# EasyEDA Pro project MAX5864_REUSE.eprj, schematic Schematic1_1
Create Date: 2024-10-05; Page Name: P1; Project Name: MAX5864_REUSE; Schematic Name: Schematic1; Update Date: 2024-10-15; Company: EasyEDA.com; Drawn: EasyEDA; Page Size: A4; Part Number: JLCPCB-002; Reviewed: EasyEDA; Version: V0.1
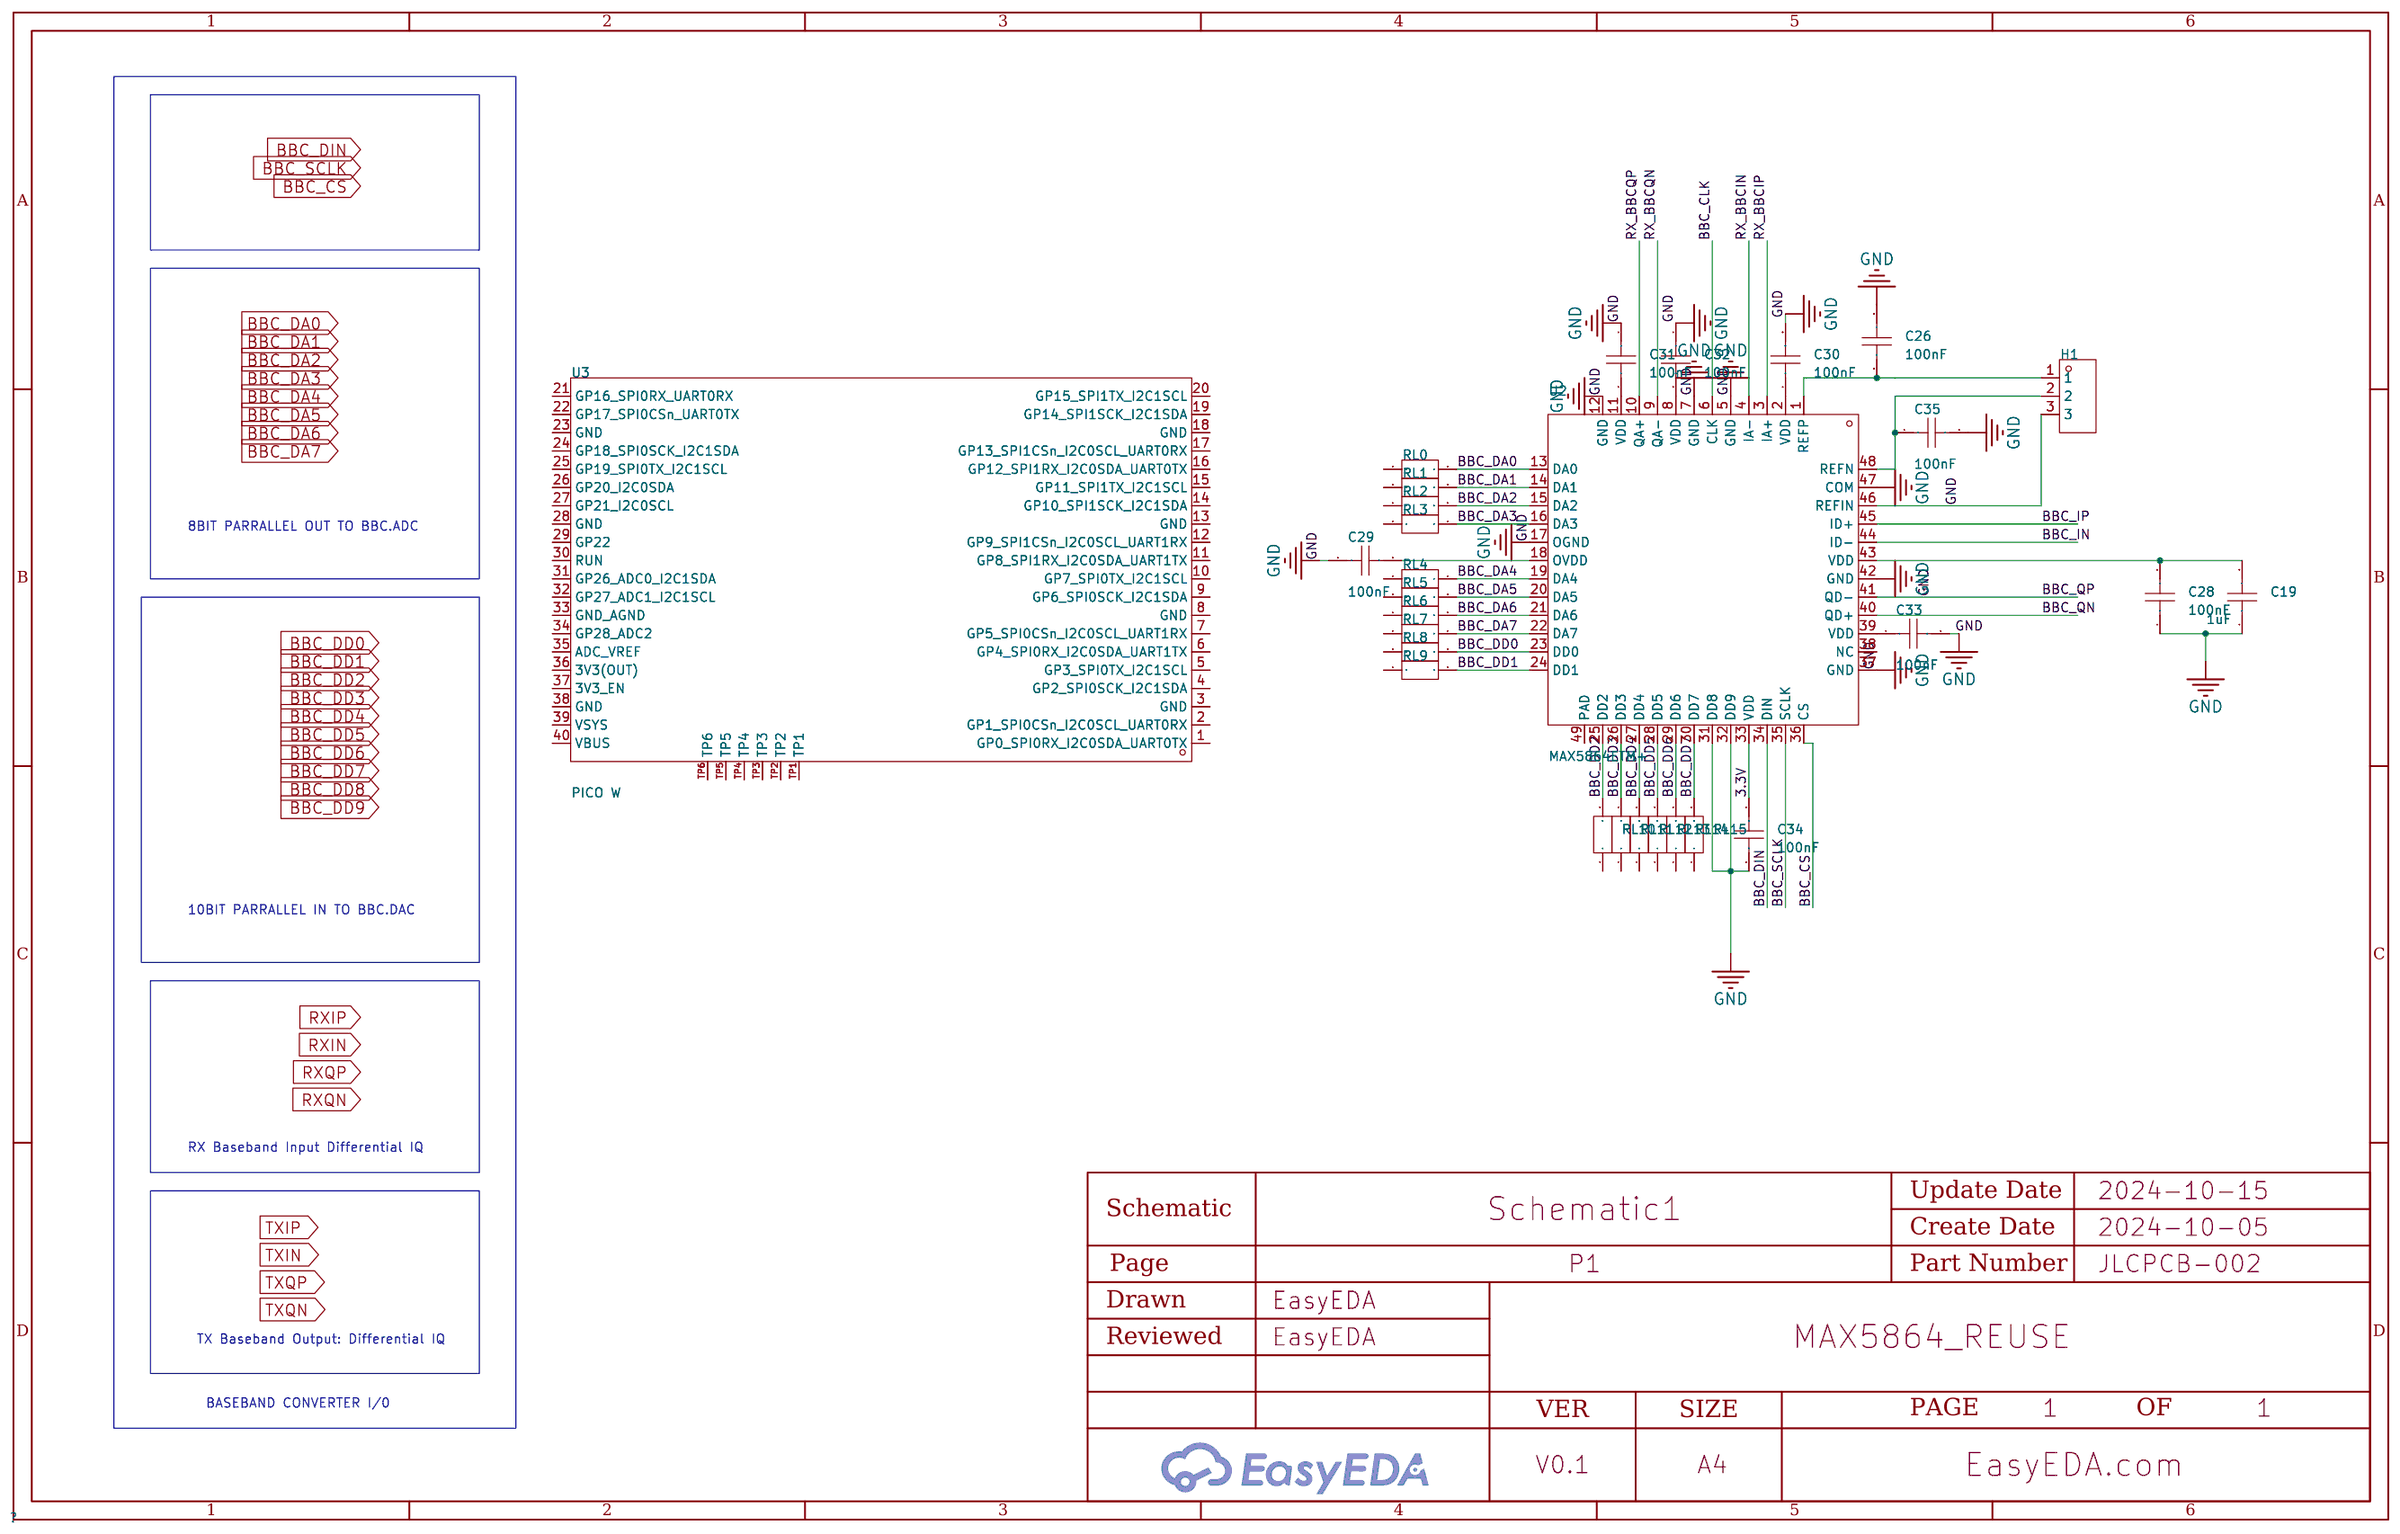
[diagram p3: schematic sheet]

## Parts
C19  1uF  [CAP-TH_L7.2-W2.5-P5.00-D0.6]
C26  100nF  [C0805]
C28  100nF  [C0805]
C29  100nF  [C0805]
C30  100nF  [C0805]
C31  100nF  [C0805]
C32  100nF  [C0805]
C33  100nF  [C0805]
C34  100nF  [C0805]
C35  100nF  [C0805]
H1  -  [HDR-TH_3P-P2.54-V-M]
RL0  PFC-W0805LF-03-1301-B  [R0805]
RL1  PFC-W0805LF-03-1301-B  [R0805]
RL2  PFC-W0805LF-03-1301-B  [R0805]
RL3  PFC-W0805LF-03-1301-B  [R0805]
RL4  PFC-W0805LF-03-1301-B  [R0805]
RL5  PFC-W0805LF-03-1301-B  [R0805]
RL6  PFC-W0805LF-03-1301-B  [R0805]
RL7  PFC-W0805LF-03-1301-B  [R0805]
RL8  PFC-W0805LF-03-1301-B  [R0805]
RL9  PFC-W0805LF-03-1301-B  [R0805]
RL10  PFC-W0805LF-03-1301-B  [R0805]
RL11  PFC-W0805LF-03-1301-B  [R0805]
RL12  PFC-W0805LF-03-1301-B  [R0805]
RL13  PFC-W0805LF-03-1301-B  [R0805]
RL14  PFC-W0805LF-03-1301-B  [R0805]
RL15  PFC-W0805LF-03-1301-B  [R0805]
U2  MAX5864ETM+  [QFN-48_L7.0-W7.0-P0.50-BL-EP5.1]
U3  PICO W  [COMM-SMD_L51.0-W21.0-P2.54_PICOW]

## Library data of the parts
C19 = SMEC334J100M2: Capacitance: Tolerance:±5% Tolerance:±5% Voltage Rated:; LCSC Part Name: 330nF ±5% 100V; Supplier Part: C401104; Manufacturer: CHAMPION(全鹏); Supplier Footprint: 插件,P=5mm; JLCPCB Part Class: Extended Part; Datasheet: https://atta.szlcsc.com/upload/public/pdf/source/20190730/C401104_3330673C3D333BC9993FC47731C2A492.pdf; Supplier: LCSC; Tolerance: ±5%
C26 C28-C35 = CAP_0805: Supplier Footprint: 0805
H1 = HDR-M_2.54_1x3P: Supplier Footprint: Through
RL0-RL15 = PFC-W0805LF-03-1301-B: Supplier Part: C22384601; JLCPCB Part Class: Extended Part; Supplier: LCSC
U2 = MAX5864ETM+: Supply Voltage:2.7V~3.3V Supply Voltage:2.7V~3.3V; LCSC Part Name: MAX5864ETM; Supplier Part: C143525; Manufacturer: ADI(亚德诺)/MAXIM(美信); Supplier Footprint: QFN-48-EP(7x7); JLCPCB Part Class: Extended Part; Datasheet: https://atta.szlcsc.com/upload/public/pdf/source/20171204/C143525_15123772477351162683.pdf; Supplier: LCSC; Supply Voltage: 2.7V~3.3V
U3 = PICO W: Supplier Part: C7203003; Manufacturer: Raspberry Pi(树莓派); JLCPCB Part Class: Extended Part; Datasheet: https://atta.szlcsc.com/upload/public/pdf/source/20230906/10B4C0665D815973E97A5F4971CA719F.pdf; Supplier: LCSC

## Nets
3.3V: C34.1 U2.33(VDD)
GND: C19.1 C26.1 C28.1 C29.1 C30.2 C31.1 C32.1 C33.2 C34.2 C35.2 U2.5(GND) U2.7(GND) U2.12(GND) U2.17(OGND) U2.31(DD8) U2.32(DD9) U2.37(GND) U2.42(GND) U2.47(COM)
BBC_CLK: U2.6(CLK)
BBC_CS: U2.36(CS)
BBC_DA0: RL0.2 U2.13(DA0)
BBC_DA1: RL1.2 U2.14(DA1)
BBC_DA2: RL2.2 U2.15(DA2)
BBC_DA3: RL3.2 U2.16(DA3)
BBC_DA4: RL4.2 U2.19(DA4)
BBC_DA5: RL5.2 U2.20(DA5)
BBC_DA6: RL6.2 U2.21(DA6)
BBC_DA7: RL7.2 U2.22(DA7)
BBC_DD0: RL8.2 U2.23(DD0)
BBC_DD1: RL9.2 U2.24(DD1)
BBC_DD2: RL10.2 U2.25(DD2)
BBC_DD3: RL11.2 U2.26(DD3)
BBC_DD4: RL12.2 U2.27(DD4)
BBC_DD5: RL13.2 U2.28(DD5)
BBC_DD6: RL14.2 U2.29(DD6)
BBC_DD7: RL15.2 U2.30(DD7)
BBC_DIN: U2.34(DIN)
BBC_IN: U2.44(ID-)
BBC_IP: U2.45(ID+)
BBC_QN: U2.40(QD+)
BBC_QP: U2.41(QD-)
BBC_SCLK: U2.35(SCLK)
RX_BBCIN: U2.4(IA-)
RX_BBCIP: U2.3(IA+)
RX_BBCQN: U2.9(QA-)
RX_BBCQP: U2.10(QA+)
$1N1830: C30.1 U2.2(VDD)
$1N1839: C29.2 U2.18(OVDD)
$1N3073: C26.2 H1.1 U2.1(REFP)
$1N3079: C35.1 H1.2 U2.48(REFN)
$1N3085: H1.3 U2.46(REFIN)
$1N3266: C19.2 C28.2 U2.43(VDD)
$1N3998: C31.2 U2.11(VDD)
$1N4024: C32.2 U2.8(VDD)
$1N4050: C33.1 U2.39(VDD)

Not connected (* = marked no-connect by the designer): RL0 1; RL1 1; RL2 1; RL3 1; RL4 1; RL5 1; RL6 1; RL7 1; RL8 1; RL9 1; RL10 1; RL11 1; RL12 1; RL13 1; RL14 1; RL15 1; U2 38(NC) 49(PAD); U3 1(GP0_SPI0RX_I2C0SDA_UART0TX) 2(GP1_SPI0CSn_I2C0SCL_UART0RX) 3(GND) 4(GP2_SPI0SCK_I2C1SDA) 5(GP3_SPI0TX_I2C1SCL) 6(GP4_SPI0RX_I2C0SDA_UART1TX) 7(GP5_SPI0CSn_I2C0SCL_UART1RX) 8(GND) 9(GP6_SPI0SCK_I2C1SDA) 10(GP7_SPI0TX_I2C1SCL) 11(GP8_SPI1RX_I2C0SDA_UART1TX) 12(GP9_SPI1CSn_I2C0SCL_UART1RX) 13(GND) 14(GP10_SPI1SCK_I2C1SDA) 15(GP11_SPI1TX_I2C1SCL) 16(GP12_SPI1RX_I2C0SDA_UART0TX) 17(GP13_SPI1CSn_I2C0SCL_UART0RX) 18(GND) 19(GP14_SPI1SCK_I2C1SDA) 20(GP15_SPI1TX_I2C1SCL) 21(GP16_SPI0RX_UART0RX) 22(GP17_SPI0CSn_UART0TX) 23(GND) 24(GP18_SPI0SCK_I2C1SDA) 25(GP19_SPI0TX_I2C1SCL) 26(GP20_I2C0SDA) 27(GP21_I2C0SCL) 28(GND) 29(GP22) 30(RUN) 31(GP26_ADC0_I2C1SDA) 32(GP27_ADC1_I2C1SCL) 33(GND_AGND) 34(GP28_ADC2) 35(ADC_VREF) 36(3V3(OUT)) 37(3V3_EN) 38(GND) 39(VSYS) 40(VBUS) TP1 TP2 TP3 TP4 TP5 TP6

## Notes on the sheet
- 8BIT PARRALLEL OUT TO BBC.ADC
- 10BIT PARRALLEL IN TO BBC.DAC
- RX Baseband Input Differential IQ
- TX Baseband Output: Differential IQ
- BASEBAND CONVERTER I/0
